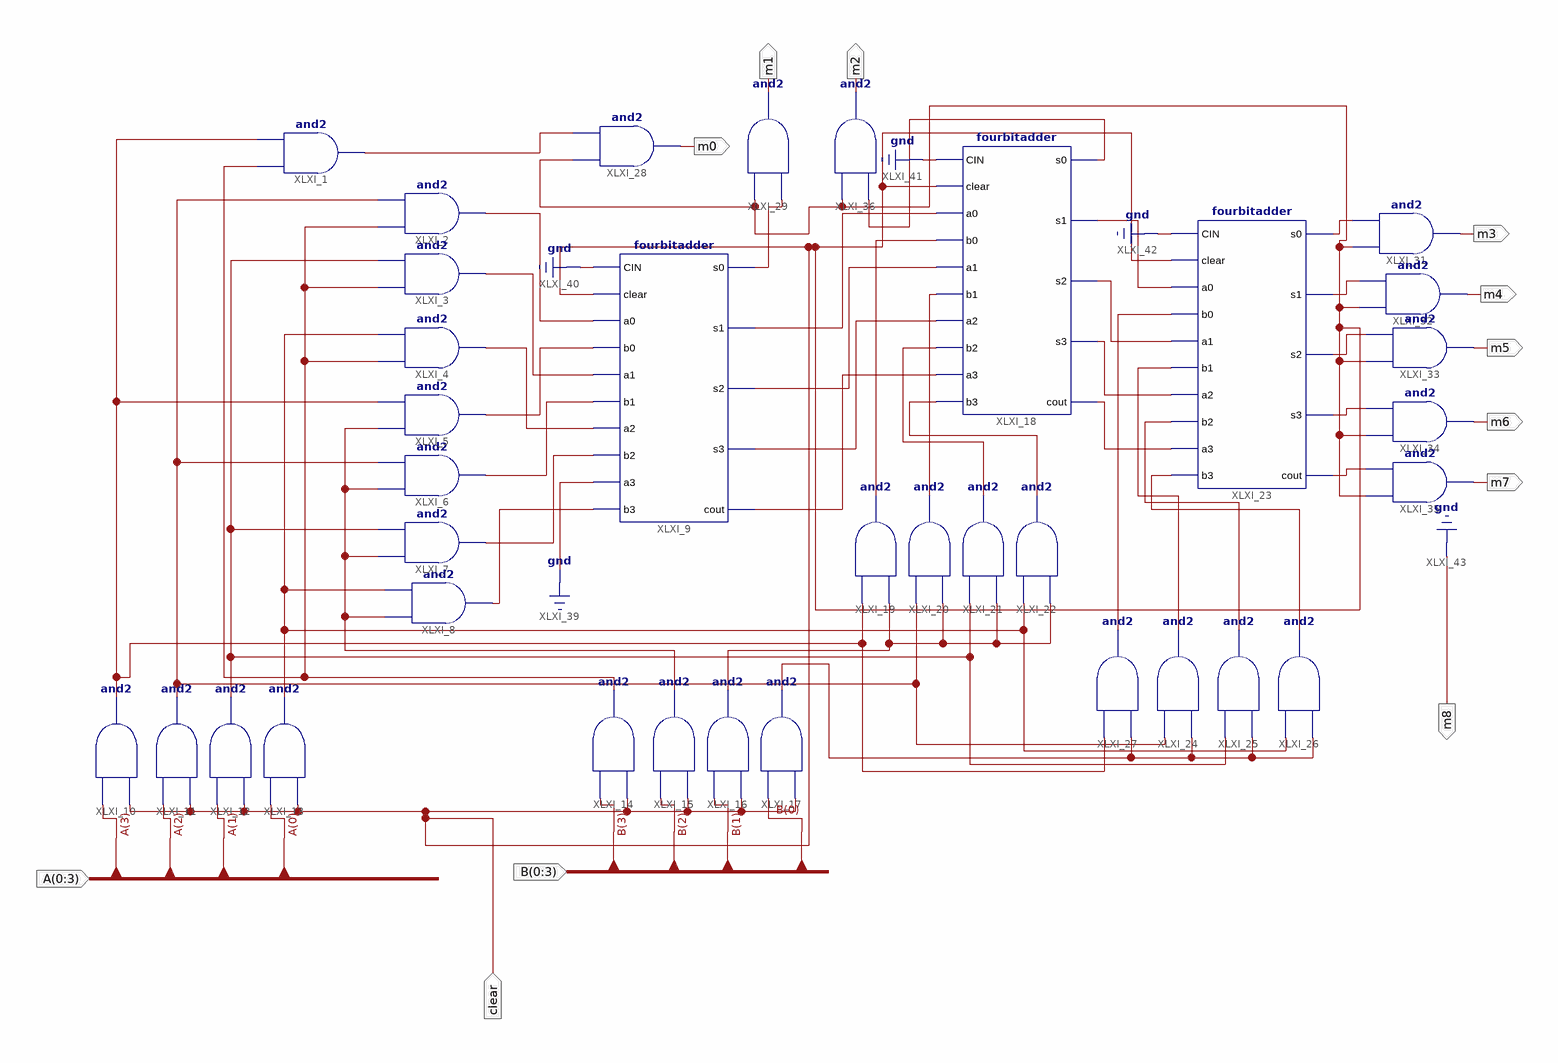
[diagram p0: schematic sheet 1]
// Xilinx ISE schematic Fourbitmultiplier.sch (artix7) as structural Verilog: 35 symbols, 12 ports
module Fourbitmultiplier (
  input  [0:3] A,
  input  [0:3] B,
  input  clear,
  output m0,
  output m1,
  output m2,
  output m3,
  output m4,
  output m5,
  output m6,
  output m7,
  output m8
);

  wire XLXN_8, XLXN_34, XLXN_45, XLXN_49, XLXN_51, XLXN_52, XLXN_53, XLXN_54, XLXN_57, XLXN_61, XLXN_74,
       XLXN_78, XLXN_79, XLXN_82, XLXN_83, XLXN_84, XLXN_86, XLXN_89, XLXN_90, XLXN_91, XLXN_92, XLXN_93,
       XLXN_95, XLXN_96, XLXN_97, XLXN_98, XLXN_99, XLXN_104, XLXN_105, XLXN_106, XLXN_107, XLXN_125,
       XLXN_126, XLXN_128, XLXN_129, XLXN_130, XLXN_131, XLXN_132, XLXN_140;

  and XLXI_1 (XLXN_125, XLXN_57, XLXN_34);
  and XLXI_2 (XLXN_49, XLXN_57, XLXN_82);
  and XLXI_3 (XLXN_51, XLXN_57, XLXN_83);
  and XLXI_4 (XLXN_52, XLXN_57, XLXN_84);
  and XLXI_5 (XLXN_45, XLXN_61, XLXN_34);
  and XLXI_6 (XLXN_53, XLXN_61, XLXN_82);
  and XLXI_7 (XLXN_54, XLXN_61, XLXN_83);
  and XLXI_8 (XLXN_8, XLXN_61, XLXN_84);
  fourbitadder XLXI_9 (
    .CIN(1'b0), .clear(clear), .a0(XLXN_49), .b0(XLXN_45), .a1(XLXN_51), .b1(XLXN_53), .a2(XLXN_52),
    .b2(XLXN_54), .a3(1'b0), .b3(XLXN_8), .s0(XLXN_126), .s1(XLXN_74), .s2(XLXN_78), .s3(XLXN_79),
    .cout(XLXN_92));
  and XLXI_10 (XLXN_34, clear, A[3]);
  and XLXI_11 (XLXN_82, clear, A[2]);
  and XLXI_12 (XLXN_83, clear, A[1]);
  and XLXI_13 (XLXN_84, clear, A[0]);
  and XLXI_14 (XLXN_57, clear, B[3]);
  and XLXI_15 (XLXN_61, clear, B[2]);
  and XLXI_16 (XLXN_86, clear, B[1]);
  and XLXI_17 (XLXN_99, clear, B[0]);
  fourbitadder XLXI_18 (
    .CIN(1'b0), .clear(clear), .a0(XLXN_74), .b0(XLXN_89), .a1(XLXN_78), .b1(XLXN_90), .a2(XLXN_79),
    .b2(XLXN_91), .a3(XLXN_92), .b3(XLXN_93), .s0(XLXN_140), .s1(XLXN_95), .s2(XLXN_96), .s3(XLXN_97),
    .cout(XLXN_98));
  and XLXI_19 (XLXN_89, XLXN_86, XLXN_34);
  and XLXI_20 (XLXN_90, XLXN_86, XLXN_82);
  and XLXI_21 (XLXN_91, XLXN_86, XLXN_83);
  and XLXI_22 (XLXN_93, XLXN_86, XLXN_84);
  fourbitadder XLXI_23 (
    .CIN(1'b0), .clear(clear), .a0(XLXN_95), .b0(XLXN_104), .a1(XLXN_96), .b1(XLXN_105), .a2(XLXN_97),
    .b2(XLXN_106), .a3(XLXN_98), .b3(XLXN_107), .s0(XLXN_128), .s1(XLXN_129), .s2(XLXN_130), .s3(XLXN_131),
    .cout(XLXN_132));
  and XLXI_24 (XLXN_105, XLXN_99, XLXN_82);
  and XLXI_25 (XLXN_106, XLXN_99, XLXN_83);
  and XLXI_26 (XLXN_107, XLXN_99, XLXN_84);
  and XLXI_27 (XLXN_104, XLXN_99, XLXN_34);
  and XLXI_28 (m0, clear, XLXN_125);
  and XLXI_29 (m1, XLXN_126, clear);
  and XLXI_31 (m3, clear, XLXN_128);
  and XLXI_32 (m4, clear, XLXN_129);
  and XLXI_33 (m5, clear, XLXN_130);
  and XLXI_34 (m6, clear, XLXN_131);
  and XLXI_35 (m7, clear, XLXN_132);
  and XLXI_36 (m2, XLXN_140, clear);

  assign m8 = 1'b0;
endmodule
